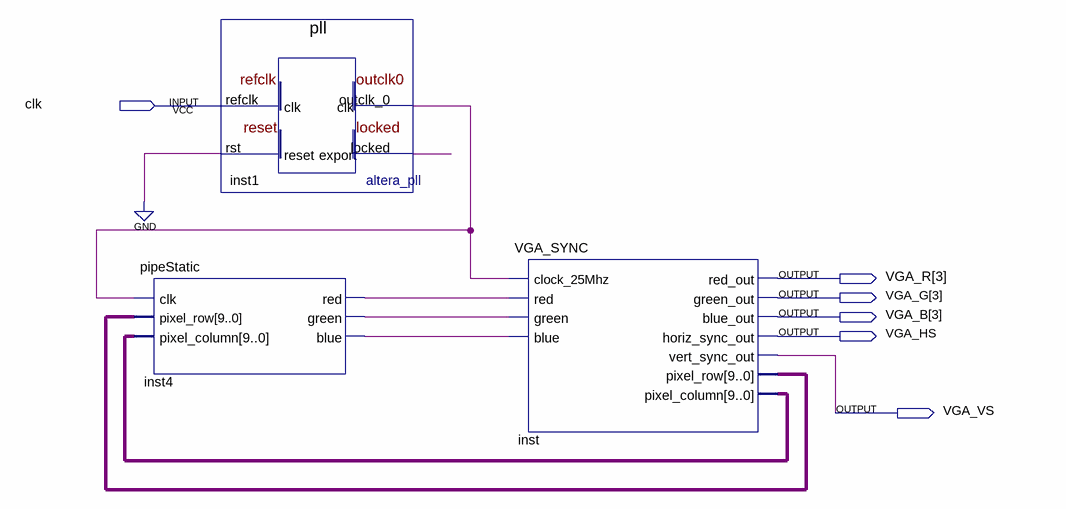
[diagram p0: schematic sheet]
// Quartus schematic pipeStaticDisplay.bdf as structural Verilog: 3 symbols, 6 pins
module pipeStaticDisplay (
  input  clk,
  output [3:3] VGA_R,
  output [3:3] VGA_G,
  output [3:3] VGA_B,
  output VGA_HS,
  output VGA_VS
);

  wire inst1_locked, inst1_outclk_0, inst4_blue, inst4_green, inst4_red;
  wire [9:0] inst_pixel_column, inst_pixel_row;

  pipeStatic inst4 (
    .clk(inst1_outclk_0), .pixel_row(inst_pixel_row), .pixel_column(inst_pixel_column), .red(inst4_red),
    .green(inst4_green), .blue(inst4_blue));
  pll inst1 (.refclk(clk), .rst(1'b0), .outclk_0(inst1_outclk_0), .locked(inst1_locked));
  VGA_SYNC inst (
    .clock_25Mhz(inst1_outclk_0), .red(inst4_red), .green(inst4_green), .blue(inst4_blue),
    .red_out(VGA_R[3]), .green_out(VGA_G[3]), .blue_out(VGA_B[3]), .horiz_sync_out(VGA_HS),
    .vert_sync_out(VGA_VS), .pixel_row(inst_pixel_row), .pixel_column(inst_pixel_column));
endmodule
